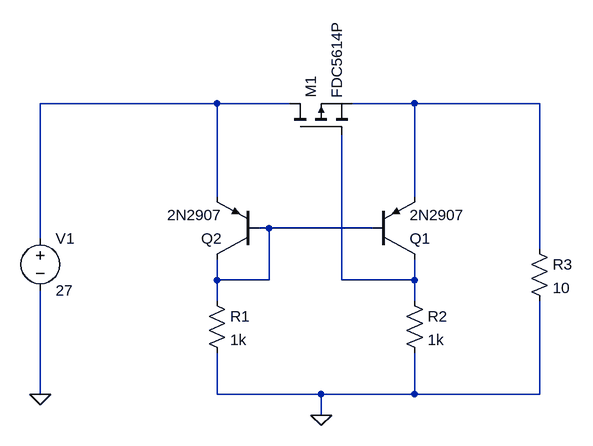
[diagram p0: schematic Draft8.asc]
Draft8.asc, the LTspice schematic file:
Version 4.1
SHEET 1 880 680
WIRE 16 64 -256 64
WIRE 128 64 16 64
WIRE 320 64 224 64
WIRE 512 64 320 64
WIRE 16 208 16 64
WIRE 320 208 320 64
WIRE 96 256 80 256
WIRE 256 256 96 256
WIRE -256 272 -256 64
WIRE 512 288 512 64
WIRE 16 336 16 304
WIRE 96 336 96 256
WIRE 96 336 16 336
WIRE 208 336 208 112
WIRE 320 336 320 304
WIRE 320 336 208 336
WIRE 16 368 16 336
WIRE 320 368 320 336
WIRE -256 512 -256 352
WIRE 16 512 16 448
WIRE 176 512 16 512
WIRE 320 512 320 448
WIRE 320 512 176 512
WIRE 512 512 512 368
WIRE 512 512 320 512
WIRE 176 544 176 512
FLAG 176 544 0
FLAG -256 512 0
SYMBOL pmos 128 112 R270
SYMATTR InstName M1
SYMATTR Value FDC5614P
SYMBOL pnp 256 304 M180
SYMATTR InstName Q1
SYMATTR Value 2N2907
SYMBOL pnp 80 304 R180
SYMATTR InstName Q2
SYMATTR Value 2N2907
SYMBOL res 0 352 R0
SYMATTR InstName R1
SYMATTR Value 1k
SYMBOL res 304 352 R0
SYMATTR InstName R2
SYMATTR Value 1k
SYMBOL voltage -256 256 R0
WINDOW 123 0 0 Left 0
WINDOW 39 0 0 Left 0
SYMATTR InstName V1
SYMATTR Value 27
SYMBOL res 496 272 R0
SYMATTR InstName R3
SYMATTR Value 10

The netlist it stands for:
* Draft8.asc
M1 N001 N004 N002 N002 FDC5614P
Q1 N004 N003 N002 0 2N2907
Q2 N003 N003 N001 0 2N2907
R1 N003 0 1k
R2 N004 0 1k
V1 N001 0 27
R3 N002 0 10
.model NPN NPN
.model PNP PNP
.lib standard.bjt
.model NMOS NMOS
.model PMOS PMOS
.lib standard.mos
.backanno
.end